# Altium schematic sheet HDMI.SchDoc
size A4; DocumentNumber: 3; SheetNumber: 3; SheetTotal: 4; PageSetup: Record=PageOptions|CenterHorizontal=True|CenterVertical=True|PrintScale=0.97|XCorrection=1.00|YCorrection=1.00|PrintKind=1|BorderSize=5000000|LeftOffset=0|BottomOffset=0|Orientation=2|PaperLength=2970|PaperWidth=2100|Scale=100|PaperSource=7|PrintQuality=600|MediaType=1|DitherType=10|PaperKind=A4|PrintScaleMode=1
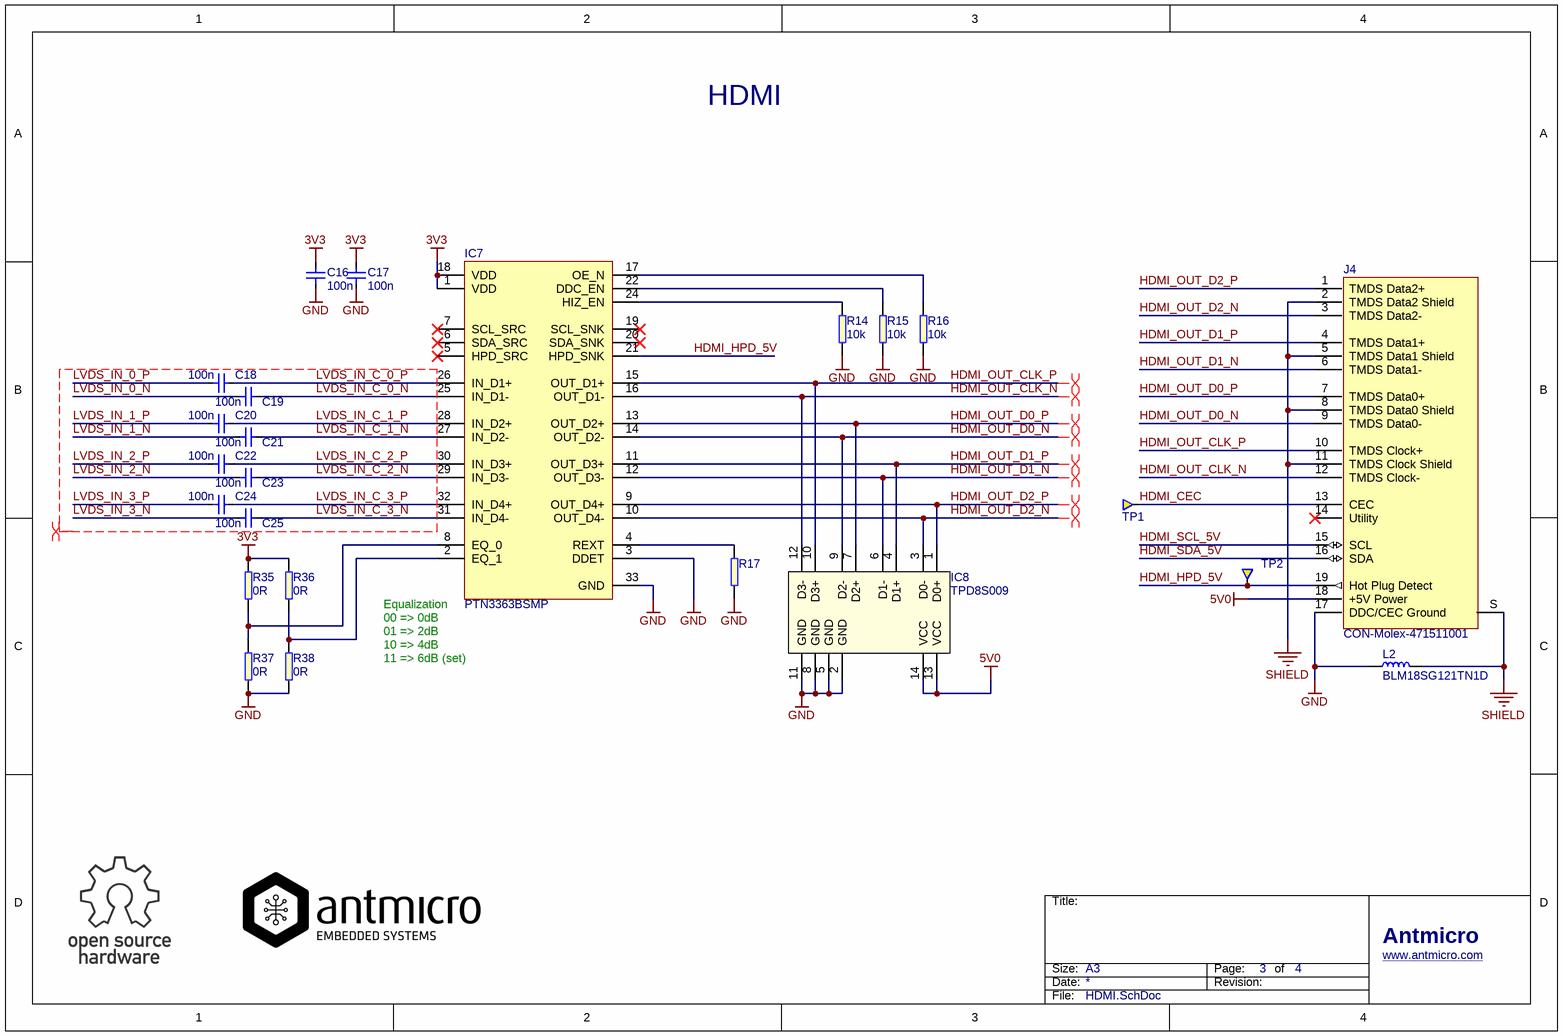
[diagram p0: HDMI.SchDoc]

## Parts
C16  100n  [0402]
C17  100n  [0402]
C18  100n  [0402]
C19  100n  [0402]
C20  100n  [0402]
C21  100n  [0402]
C22  100n  [0402]
C23  100n  [0402]
C24  100n  [0402]
C25  100n  [0402]
IC7  PTN3363BSMP  [QFN-32]
IC8  TPD8S009  [SON-15]
J4  CON-Molex-471511001  [Molex_HDMI_471511001]
L2  BLM18SG121TN1D  [0603]
R14  10k  [0402]
R15  10k  [0402]
R16  10k  [0402]
R17  12k4  [0402]  (value not drawn)
R35  0R  [0603]
R36  0R  [0603]
R37  0R  [0603]
R38  0R  [0603]
TP1  Testpad  [Testpad]  (value not drawn)  (no BOM)
TP2  Testpad  [Testpad]  (value not drawn)  (no BOM)

## Nets
3V3: C16.2 C17.2 IC7.1(VDD) IC7.18(VDD) R35.1 R36.1
5V0: IC8.13(VCC) IC8.14(VCC) J4.18(+5V_Power)
GND: C16.1 C17.1 IC7.3(DDET) IC7.33(GND) IC8.2(GND) IC8.5(GND) IC8.8(GND) IC8.11(GND) J4.17(DDC/CEC_Ground) L2.1 R14.2 R15.2 R16.2 R17.1 R37.2 R38.2
SHIELD: J4.2(TMDS_Data2_Shield) J4.5(TMDS_Data1_Shield) J4.8(TMDS_Data0_Shield) J4.11(TMDS_Clock_Shield) J4.S(SH) L2.2
HDMI_CEC: J4.13(CEC) TP1.1
HDMI_HPD_5V: IC7.21(HPD_SNK) J4.19(Hot_Plug_Detect) TP2.1
HDMI_OUT_CLK_N: IC7.16(OUT_D1-) IC8.12(D3-) J4.12(TMDS_Clock-)
HDMI_OUT_CLK_P: IC7.15(OUT_D1+) IC8.10(D3+) J4.10(TMDS_Clock+)
HDMI_OUT_D0_N: IC7.14(OUT_D2-) IC8.9(D2-) J4.9(TMDS_Data0-)
HDMI_OUT_D0_P: IC7.13(OUT_D2+) IC8.7(D2+) J4.7(TMDS_Data0+)
HDMI_OUT_D1_N: IC7.12(OUT_D3-) IC8.6(D1-) J4.6(TMDS_Data1-)
HDMI_OUT_D1_P: IC7.11(OUT_D3+) IC8.4(D1+) J4.4(TMDS_Data1+)
HDMI_OUT_D2_N: IC7.10(OUT_D4-) IC8.3(D0-) J4.3(TMDS_Data2-)
HDMI_OUT_D2_P: IC7.9(OUT_D4+) IC8.1(D0+) J4.1(TMDS_Data2+)
HDMI_SCL_5V: J4.15(SCL)
HDMI_SDA_5V: J4.16(SDA)
LVDS_IN_0_N: C19.1
LVDS_IN_0_P: C18.1
LVDS_IN_1_N: C21.1
LVDS_IN_1_P: C20.1
LVDS_IN_2_N: C23.1
LVDS_IN_2_P: C22.1
LVDS_IN_3_N: C25.1
LVDS_IN_3_P: C24.1
LVDS_IN_C_0_N: C19.2 IC7.25(IN_D1-)
LVDS_IN_C_0_P: C18.2 IC7.26(IN_D1+)
LVDS_IN_C_1_N: C21.2 IC7.27(IN_D2-)
LVDS_IN_C_1_P: C20.2 IC7.28(IN_D2+)
LVDS_IN_C_2_N: C23.2 IC7.29(IN_D3-)
LVDS_IN_C_2_P: C22.2 IC7.30(IN_D3+)
LVDS_IN_C_3_N: C25.2 IC7.31(IN_D4-)
LVDS_IN_C_3_P: C24.2 IC7.32(IN_D4+)
NetIC7_2: IC7.2(EQ_1) R36.2 R38.1
NetIC7_4: IC7.4(REXT) R17.2
NetIC7_8: IC7.8(EQ_0) R35.2 R37.1
NetIC7_17: IC7.17(OE_N) R16.1
NetIC7_22: IC7.22(DDC_EN) R15.1
NetIC7_24: IC7.24(HIZ_EN) R14.1

Not connected (* = marked no-connect by the designer): IC7 5(HPD_SRC)* 6(SDA_SRC)* 7(SCL_SRC)* 19(SCL_SNK)* 20(SDA_SNK)*; J4 14(Utility)*

## Layout directives
differential pair: HDMI_OUT_CLK_N, HDMI_OUT_CLK_P, HDMI_OUT_D0_N, HDMI_OUT_D0_P, HDMI_OUT_D1_N, HDMI_OUT_D1_P, HDMI_OUT_D2_N, HDMI_OUT_D2_P, LVDS_IN_0_N, LVDS_IN_0_P, LVDS_IN_1_N, LVDS_IN_1_P, LVDS_IN_2_N, LVDS_IN_2_P, LVDS_IN_3_N, LVDS_IN_3_P, LVDS_IN_C_0_N, LVDS_IN_C_0_P, LVDS_IN_C_1_N, LVDS_IN_C_1_P, LVDS_IN_C_2_N, LVDS_IN_C_2_P, LVDS_IN_C_3_N, LVDS_IN_C_3_P

## Notes on the sheet
- HDMI
- (near IC7) 00 => 0dB
- (near IC7) 01 => 2dB
- 10 => 4dB
- (near IC7) Equalization
- 11 => 6dB (set)
- Title:
- Size:
- Date:
- A3
- Revision:
- Page:
- of
- Antmicro
- www.antmicro.com
- File:

## Library data of the parts
C16-C25 = C_100n_0402: MLCC SMT Capacitor 0402; Manufacturer: MULTICOMP; Part Symbol: MC0402X104M100CT; Value: 100n; Part Number: C_100n_0402
IC7 = PTN3363: HDMI level shifter; Manufacturer: NXP; Part Number: PTN3363BSMP; Value: PTN3363BSMP; Part Symbol: PTN3363BSMP
IC8 = TPD8S009: 8-Channel ESD Protection for DisplayPort and HDMI; Manufacturer: TEXAS INSTRUMENTS; Part Symbol: TPD8S009DSMR; Part Number: TPD8S009; Value: TPD8S009
J4 = CON-Molex-471511001: Header right angle HDMI; Manufacturer: MOLEX; Value: 47151-1001; Part Number: CON-Molex-471511001; Part Symbol: 47151-1001
L2 = Inductor SMT: FERRITE BEAD, 0.025OHM, 3A, 0603; Manufacturer: MURATA; Part Number: BLM18SG121TN1D; Value: BLM18SG121TN1D; Part Symbol: BLM18SG121TN1D
R14-R16 = R_10k_0402: SMT Resistor 0402; Manufacturer: MULTICOMP; Part Symbol: MCMR04X1002FTL; Value: 10k; Part Number: R_10k_0402
R17 = R_12k4_0402_1%: SMT Resistor 12k4 0402 1%; Manufacturer: MULTICOMP; Part Symbol: MC00625W0402112K4; Value: 12k4; Part Number: R_12k4_0402_1%
R35-R38 = R_0R_0603: SMT Resistor 0R 0603; Manufacturer: BOURNS; Part Symbol: CR0603-J/-000ELF; Value: 0R; Part Number: R_0R_0603
TP1 TP2 = Testpad: Testpad 2mm diameter; Manufacturer: PCB ONLY; Part Number: Testpad; Part Symbol: PCB ONLY